# Altium schematic sheet MecParts.SchDoc: =SchTitle
size A4; Author: JMO; Organization: ETML; Address1: Rue de Sébeillon12; Address2: CH - 1004 Lausanne; Address3: Tél. 021 316 77 77; Address4: www.etml.ch; Revision: 17300C; SheetNumber: 4; SheetTotal: 5; Replace: .; Modifa: Schéma initial  en version C; ModB: .; ModC: .; ModD: .; SPICEModelCacheLYDHXSVX: <root> / <DocumentId>LYDHXSVX</DocumentId> / </root>; Version: C
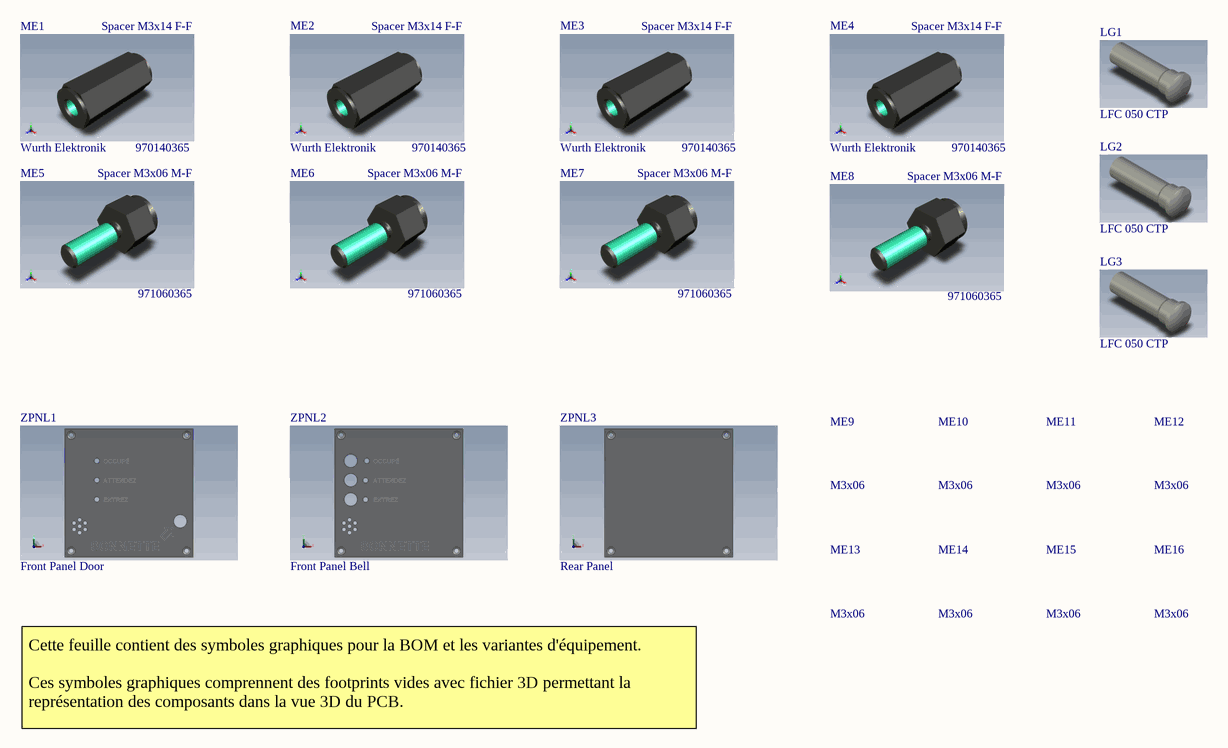
[diagram p0: MecParts.SchDoc]

## Parts
LG1  LFC 050 CTP  [Light Guide LFC050]
LG2  LFC 050 CTP  [Light Guide LFC050]
LG3  LFC 050 CTP  [Light Guide LFC050]
ME1  Spacer M3x14 F-F  Manufacturer: Wurth Elektronik  Manufacturer Part Number: 970140365  [M3x14_FF_970140365]
ME2  Spacer M3x14 F-F  Manufacturer: Wurth Elektronik  Manufacturer Part Number: 970140365  [M3x14_FF_970140365]
ME3  Spacer M3x14 F-F  Manufacturer: Wurth Elektronik  Manufacturer Part Number: 970140365  [M3x14_FF_970140365]
ME4  Spacer M3x14 F-F  Manufacturer: Wurth Elektronik  Manufacturer Part Number: 970140365  [M3x14_FF_970140365]
ME5  Spacer M3x06 M-F  Manufacturer Part Number: 971060365  [M3X06_MF_971060365]
ME6  Spacer M3x06 M-F  Manufacturer Part Number: 971060365  [M3X06_MF_971060365]
ME7  Spacer M3x06 M-F  Manufacturer Part Number: 971060365  [M3X06_MF_971060365]
ME8  Spacer M3x06 M-F  Manufacturer Part Number: 971060365  [M3X06_MF_971060365]
ME9  M3x06  [M3x06 Screw Height_16]
ME10  M3x06  [M3x06 Screw Height_16]
ME11  M3x06  [M3x06 Screw Height_16]
ME12  M3x06  [M3x06 Screw Height_16]
ME13  M3x06  [M3x06 Screw Height_8]
ME14  M3x06  [M3x06 Screw Height_8]
ME15  M3x06  [M3x06 Screw Height_8]
ME16  M3x06  [M3x06 Screw Height_8]
ZPNL1  Front Panel Door  [Face AV Door]
ZPNL2  Front Panel Bell  [Face avant Bell]
ZPNL3  Rear Panel  [Face Arriere]

## Notes on the sheet
- Cette feuille contient des symboles graphiques pour la BOM et les variantes d'équipement.
  Ces symboles graphiques comprennent des footprints vides avec fichier 3D permettant la représentation des composants dans la vue 3D du PCB.
- Fichier :
- a
- Date :
- Heure :
- Version :
- Auteur :
- Modif.
- b
- c
- d
- Projet :
- No :
- Nb feuilles
- Feuille n°
- Chemin :

## Library data of the parts
LG1-LG3 = LightPipe LFC050CTP: Light Guide pour panneau pour Leds
ME1-ME4 = Spacer M3x14 F-F: Hexagonal Plastic Spacer Stud, M3x14 F-F; Inner Thread: M3; Inner Thread Length: 14; Wrench: 6; Length: 14
ME5-ME8 = Spacer M3x06 M-F: Hexagonal Plastic Spacer Stud, M3x06 M-F; Manufacturer: Wurth Elektronik; Inner Thread: M3; Inner Thread Length: 3; Outer Thread Length: 8; Wrench: 6; Length: 5; Outer Thread: M3
ME9-ME16 = M3x06 Countersunk: M3x06 Coutersunk screw
ZPNL1 = Panel Face Avant (Door): Panneau de face avant de porte (Portier electronique)
ZPNL2 = Panel Face Avant (Bell): Panneau de face avant de porte (Portier electronique)
ZPNL3 = Panel Face Arriere: Panneau de face arriere de porte (Portier electronique)